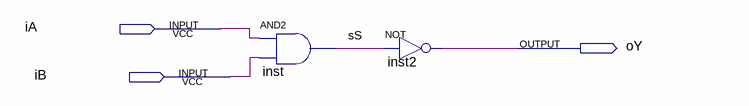
[diagram p0: schematic sheet]
// Quartus schematic DigitalSystem.bdf as structural Verilog: 2 symbols, 3 pins
module DigitalSystem (
  input  iA,
  input  iB,
  output oY
);

  wire sS;

  and inst (sS, iA, iB);
  not inst2 (oY, sS);
endmodule
